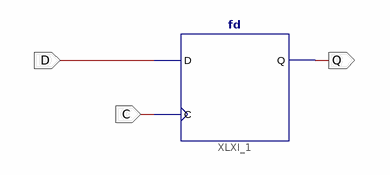
[diagram p0: schematic sheet 1]
// Xilinx ISE schematic buffer_1bit.sch (spartan6) as structural Verilog: 1 symbols, 3 ports
module buffer_1bit (
  input  D,
  input  C,
  output Q
);

  fd XLXI_1 (.C(C), .D(D), .Q(Q));
endmodule
